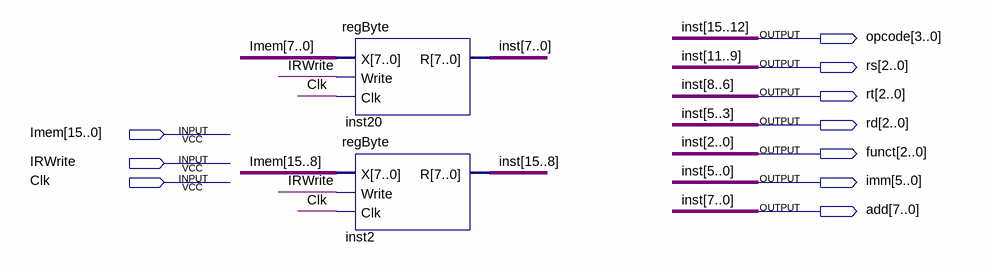
[diagram p0: schematic sheet]
// Quartus schematic instReg.bdf as structural Verilog: 2 symbols, 10 pins
module instReg (
  input  [15:0] Imem,
  input  IRWrite,
  input  Clk,
  output [3:0] opcode,
  output [2:0] rs,
  output [2:0] rt,
  output [2:0] rd,
  output [2:0] funct,
  output [5:0] imm,
  output [7:0] add
);

  regByte inst20 (.X(Imem[7:0]), .Write(IRWrite), .Clk(Clk), .R(add));
  regByte inst2 (.X(Imem[15:8]), .Write(IRWrite), .Clk(Clk), .R({opcode, rs, rt[2]}));

  assign funct = add[2:0];
  assign imm = add[5:0];
  assign rd = add[5:3];
  assign rt[1:0] = add[7:6];

  // Other names for the same wires on the sheet: inst[15:0] = {opcode, rs, rt[2], add}
endmodule
